# Altium project Sensor_LFR.PrjPcb
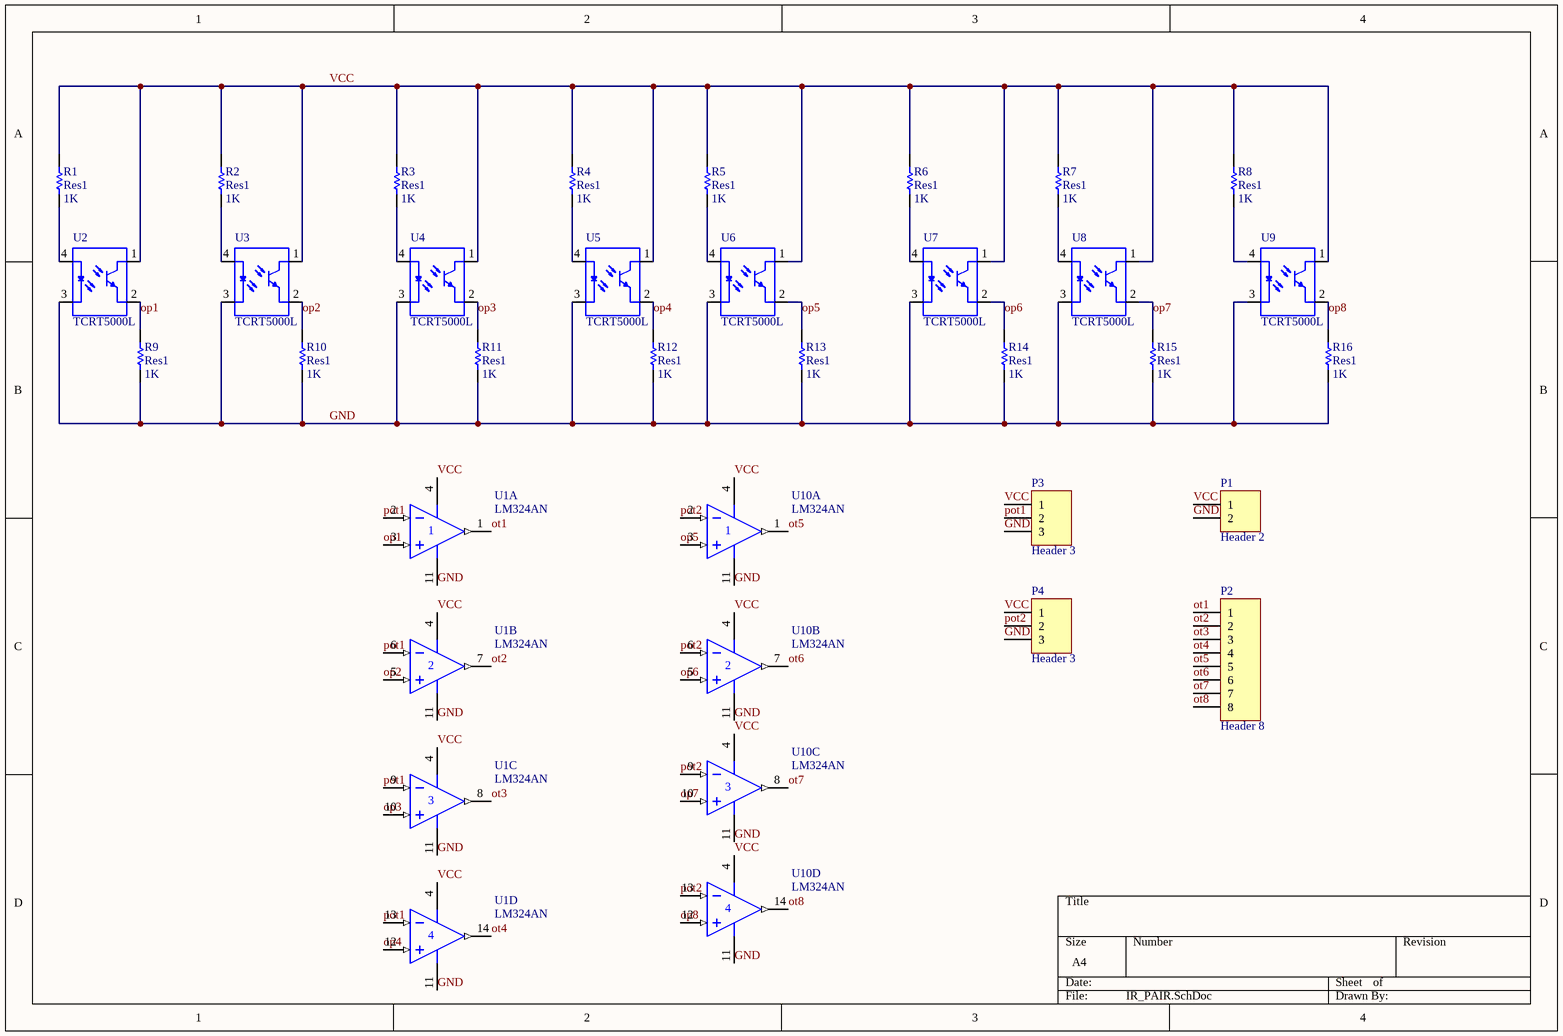
[diagram p0: IR_PAIR.SchDoc]
1 sheet, 30 parts. Net scope: global (net labels, ports and power ports of the same name join across sheets).
Board file: IR_PAIR.PcbDoc

## Sheet IR_PAIR.SchDoc
size A4

### Parts
P1  Header 2  [HDR1X2]
P2  Header 8  [HDR1X8]
P3  Header 3  [HDR1X3]
P4  Header 3  [HDR1X3]
R1  Res1  value 1K  [AXIAL-0.3]
R2  Res1  value 1K  [AXIAL-0.3]
R3  Res1  value 1K  [AXIAL-0.3]
R4  Res1  value 1K  [AXIAL-0.3]
R5  Res1  value 1K  [AXIAL-0.3]
R6  Res1  value 1K  [AXIAL-0.3]
R7  Res1  value 1K  [AXIAL-0.3]
R8  Res1  value 1K  [AXIAL-0.3]
R9  Res1  value 1K  [AXIAL-0.3]
R10  Res1  value 1K  [AXIAL-0.3]
R11  Res1  value 1K  [AXIAL-0.3]
R12  Res1  value 1K  [AXIAL-0.3]
R13  Res1  value 1K  [AXIAL-0.3]
R14  Res1  value 1K  [AXIAL-0.3]
R15  Res1  value 1K  [AXIAL-0.3]
R16  Res1  value 1K  [AXIAL-0.3]
U1  LM324AN  [N014]  (parts A,B,C,D of 4)
U2  TCRT5000L  [XDCR_TCRT5000L]
U3  TCRT5000L  [XDCR_TCRT5000L]
U4  TCRT5000L  [XDCR_TCRT5000L]
U5  TCRT5000L  [XDCR_TCRT5000L]
U6  TCRT5000L  [XDCR_TCRT5000L]
U7  TCRT5000L  [XDCR_TCRT5000L]
U8  TCRT5000L  [XDCR_TCRT5000L]
U9  TCRT5000L  [XDCR_TCRT5000L]
U10  LM324AN  [N014]  (parts A,B,C,D of 4)

### Nets
GND: P1.2 P3.3 P4.3 R9.1 R10.1 R11.1 R12.1 R13.1 R14.1 R15.1 R16.1 U1.11(V-) U2.3(C) U3.3(C) U4.3(C) U5.3(C) U6.3(C) U7.3(C) U8.3(C) U9.3(C) U10.11(V-)
op1: R9.2 U1.3(IN+) U2.2(E)
op2: R10.2 U1.5(IN+) U3.2(E)
op3: R11.2 U1.10(IN+) U4.2(E)
op4: R12.2 U1.12(IN+) U5.2(E)
op5: R13.2 U6.2(E) U10.3(IN+)
op6: R14.2 U7.2(E) U10.5(IN+)
op7: R15.2 U8.2(E) U10.10(IN+)
op8: R16.2 U9.2(E) U10.12(IN+)
ot1: P2.1 U1.1(OUT)
ot2: P2.2 U1.7(OUT)
ot3: P2.3 U1.8(OUT)
ot4: P2.4 U1.14(OUT)
ot5: P2.5 U10.1(OUT)
ot6: P2.6 U10.7(OUT)
ot7: P2.7 U10.8(OUT)
ot8: P2.8 U10.14(OUT)
pot1: P3.2 U1.2(IN-) U1.6(IN-) U1.9(IN-) U1.13(IN-)
pot2: P4.2 U10.2(IN-) U10.6(IN-) U10.9(IN-) U10.13(IN-)
VCC: P1.1 P3.1 P4.1 R1.2 R2.2 R3.2 R4.2 R5.2 R6.2 R7.2 R8.2 U1.4(V+) U2.1(CO) U3.1(CO) U4.1(CO) U5.1(CO) U6.1(CO) U7.1(CO) U8.1(CO) U9.1(CO) U10.4(V+)
NetR1_1: R1.1 U2.4(A)
NetR2_1: R2.1 U3.4(A)
NetR3_1: R3.1 U4.4(A)
NetR4_1: R4.1 U5.4(A)
NetR5_1: R5.1 U6.4(A)
NetR6_1: R6.1 U7.4(A)
NetR7_1: R7.1 U8.4(A)
NetR8_1: R8.1 U9.4(A)

### Library data of the parts
P1 = Header 2: Header, 2-Pin; LatestRevisionDate: 17-Jul-2002; LatestRevisionNote: Re-released for DXP Platform.; Publisher: Altium Limited
P2 = Header 8: Header, 8-Pin; LatestRevisionDate: 17-Jul-2002; LatestRevisionNote: Re-released for DXP Platform.; Publisher: Altium Limited
P3 P4 = Header 3: Header, 3-Pin; LatestRevisionDate: 17-Jul-2002; LatestRevisionNote: Re-released for DXP Platform.; Publisher: Altium Limited
R1-R16 = Res1: Resistor; Published: 8-Jun-2000; LatestRevisionDate: 17-Jul-2002; LatestRevisionNote: Re-released for DXP Platform.; PackageReference: AXIAL-0.3; Publisher: Altium Limited; PackageDescription: Axial Device, Thru-Hole; 2 Leads; 0.3 in Pin Spacing
U1 U10 = LM324AN: Quadruple Operational Amplifier; Published: 15-Apr-2002; LatestRevisionDate: 04-Mar-2005; LatestRevisionNote: Stylized 3D Model Added.; DatasheetVersion: Jan-1989; PackageVersion: Oct-1995; PackageReference: N014; Publisher: Altium Limited; PackageDescription: DIP; 14 Leads; Row Spacing 7.62 mm; Pitch 2.54 mm; ComponentLink1Description: Manufacturer Link; ComponentLink1URL: http://www.ti.com/; ComponentLink2Description: Datasheet; ComponentLink2URL: http://www-s.ti.com/sc/ds/lm324.pdf
U2-U9 = TCRT5000L: TCRT5000 Series 940 nm 100 mA 60 mA Transistor Output Reflective Optical Sensor; MF: Vishay Semiconductor; Price: None; Package: PCB Mount Vishay; SnapEDA_Link: https://www.snapeda.com/parts/TCRT5000L/Vishay%20Semiconductor%20Opto%20Division/view-part/?ref=snap; Availability: Unavailable; MP: TCRT5000L; Value: *